# EAGLE board Rable (EAGLE 9.6.1), part 1 of 2
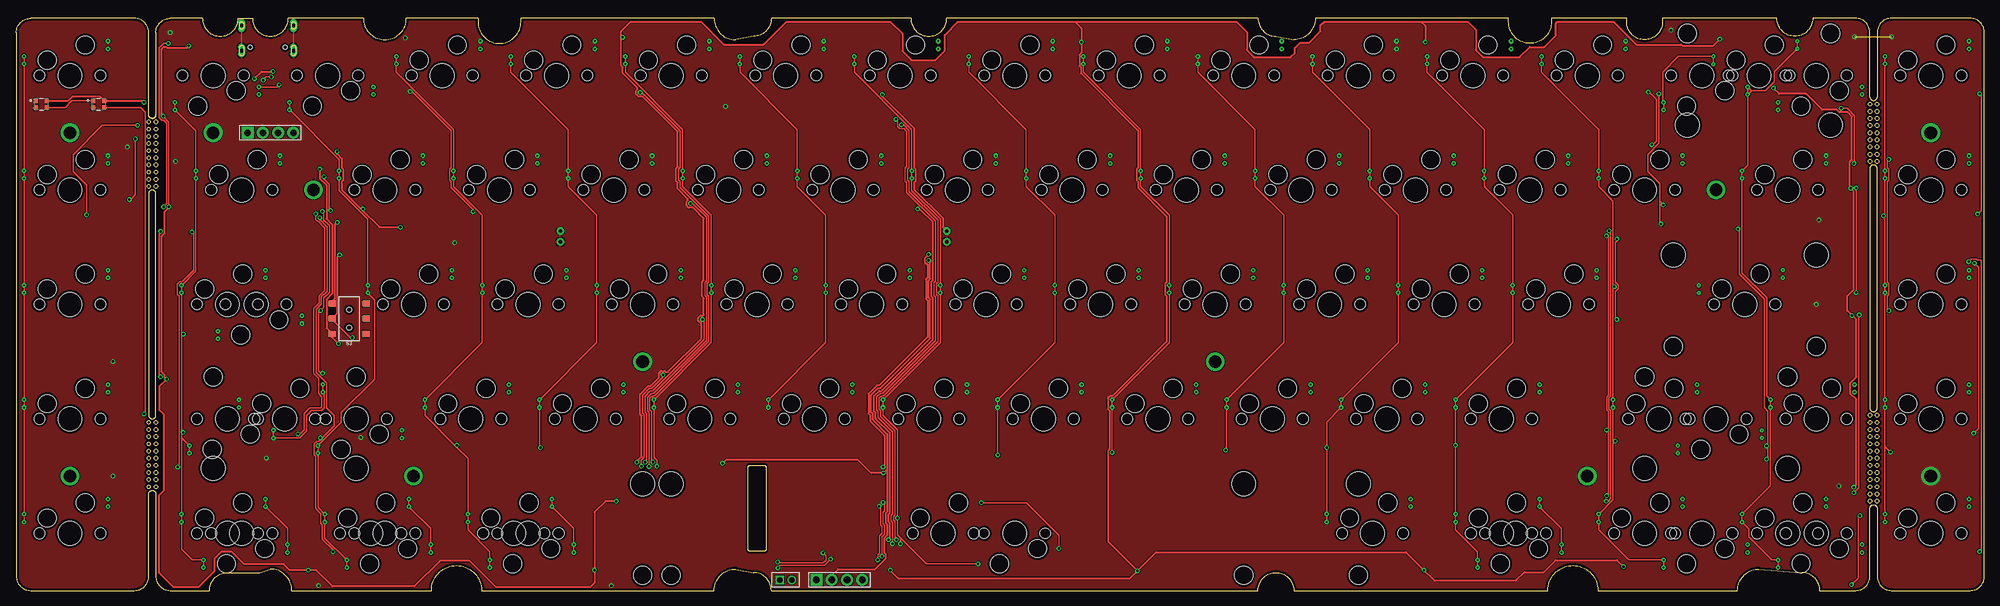
[diagram p2: board, top side]
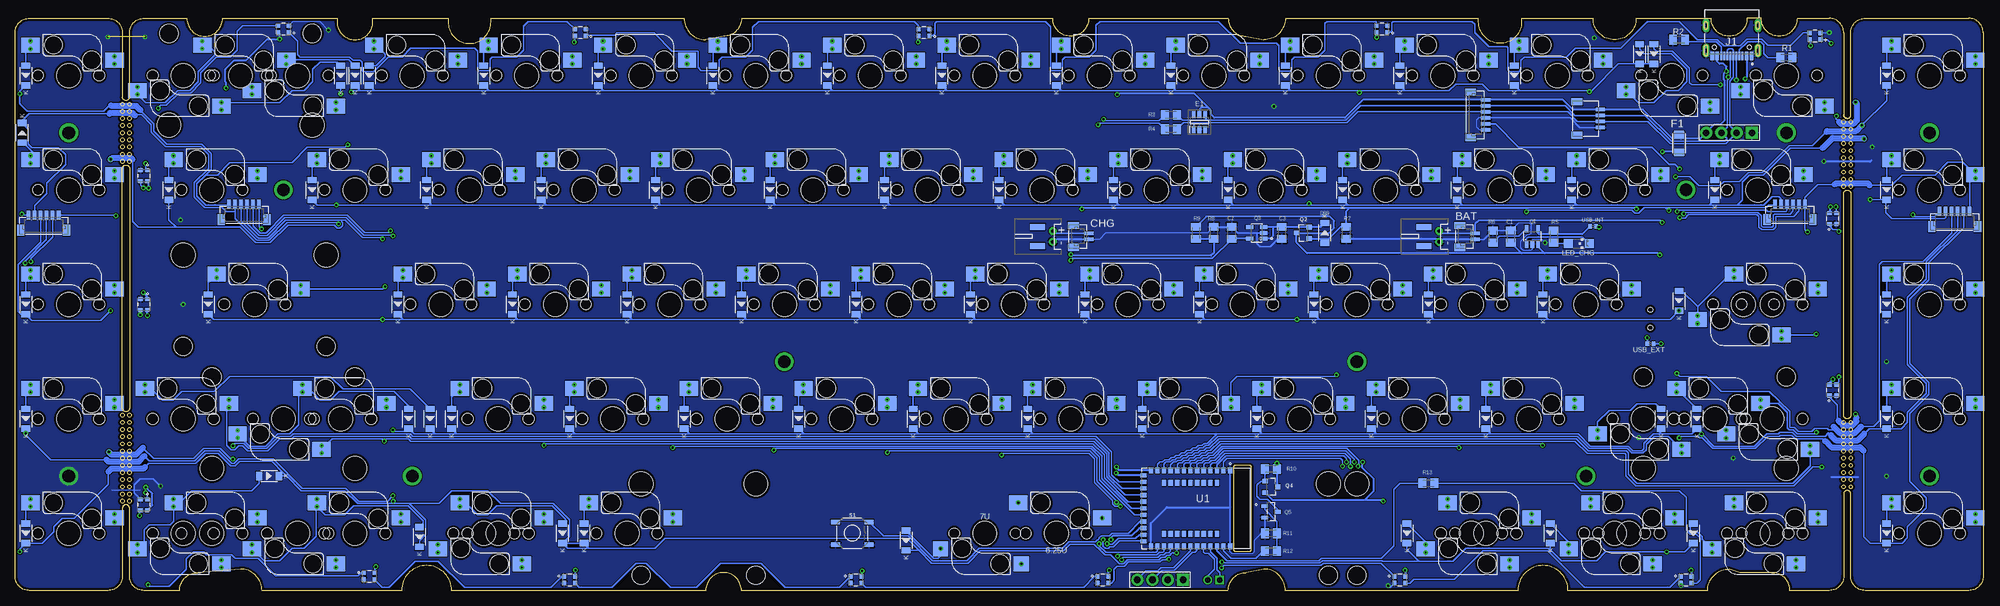
[diagram p3: board, bottom side, seen from below]

Size 327.42 x 95.25 mm. Coordinates in mm from the lower left corner, seen from the top.
Outline: 23.22,79.18 23.22,92.87 arc-90 25.6,95.25 30.96,95.25 arc90 33.93,92.27 arc90 36.91,95.25 39.29,95.25 arc90 42.27,92.27 arc90 45.24,95.25 57.75,95.25 arc90 61.32,91.68 arc90 64.89,95.25 76.8,95.25 76.8,94.65 arc90 80.37,91.08 arc90 83.94,94.65 83.94,95.25 116.09,95.25 arc90 119.66,91.68 122.63,92.27 arc90 125.61,95.25 148.83,95.25 arc90 151.81,92.27 arc90 154.78,95.25 206.57,95.25 arc90 209.55,92.27 212.53,91.68 arc90 216.1,95.25 248.25,95.25 248.25,94.65 arc90 251.82,91.08 arc90 255.39,94.65 255.39,95.25 267.89,95.25 267.89,94.65 arc90 270.87,91.68 arc90 273.84,94.65 273.84,95.25 292.89,95.25 arc90 295.87,92.27 arc90 298.85,95.25 305.99,95.25 arc-90 308.37,92.87 308.37,82.15 arc90 308.97,81.56 arc90 309.56,82.15 309.56,92.87 arc-90 311.94,95.25 325.04,95.25 arc-90 327.42,92.87 327.42,2.38 arc-90 325.04,0 311.94,0 arc-90 309.56,2.38 309.56,12.5 309.56,13.1 309.56,13.69 arc90 308.97,14.29 arc90 308.37,13.69 308.37,13.1 308.37,2.38 arc-90 305.99,0 300.04,0 arc90 297.06,2.98 289.92,3.57 arc90 286.35,0 263.13,0 arc90 258.96,4.17 arc90 254.79,0 212.53,0 arc90 209.55,2.98 arc90 206.57,0 125.61,0 arc90 122.63,2.98 119.66,3.57 arc90 116.09,0 77.39,0 arc90 73.22,4.17 arc90 69.06,0 45.84,0 arc90 42.27,3.57 40.48,2.98 35.12,2.98 arc90 32.15,0 25.6,0 arc-90 23.22,2.38 23.22,16.07 arc90 22.62,16.67 arc90 22.03,16.07 22.03,2.38 arc-90 19.65,0 2.38,0 arc-90 0,2.38 0,92.87 arc-90 2.38,95.25 19.65,95.25 arc-90 22.03,92.87 22.03,79.18 arc90 22.62,78.58
Outline: 22.62,78.58 arc90 23.22,79.18
Outline: 23.22,79.18 arc-90 22.62,78.58
Outline: 121.74,20.54 arc-90 122.04,20.84 124.42,20.84 arc-90 124.72,20.54 124.72,6.85 arc-90 124.42,6.55 122.04,6.55 arc-90 121.74,6.85 121.74,20.54
Outline: 22.03,29.17 arc90 22.62,28.58 arc90 23.22,29.17 23.22,66.08 arc90 22.62,66.67 arc90 22.03,66.08 22.03,29.17
Outline: 309.56,70.25 arc90 308.97,70.84 arc90 308.37,70.25 308.37,30.36 arc90 308.97,29.77 arc90 309.56,30.36 309.56,70.25
Outline: circle at 22.03,17.26 radius 0.3
Outline: circle at 22.03,18.45 radius 0.3
Outline: circle at 22.03,19.65 radius 0.3
Outline: circle at 22.03,20.84 radius 0.3
Outline: circle at 22.03,22.03 radius 0.3
Outline: circle at 22.03,23.22 radius 0.3
Outline: circle at 22.03,24.41 radius 0.3
Outline: circle at 22.03,25.6 radius 0.3
Outline: circle at 22.03,26.79 radius 0.3
Outline: circle at 22.03,27.98 radius 0.3
Outline: circle at 23.22,27.98 radius 0.3
Outline: circle at 23.22,26.79 radius 0.3
Outline: circle at 23.22,25.6 radius 0.3
Outline: circle at 23.22,24.41 radius 0.3
Outline: circle at 23.22,23.22 radius 0.3
Outline: circle at 23.22,22.03 radius 0.3
Outline: circle at 23.22,20.84 radius 0.3
Outline: circle at 23.22,19.65 radius 0.3
Outline: circle at 23.22,18.45 radius 0.3
Outline: circle at 23.22,17.26 radius 0.3
Copper layers (1*16): Top 0.035mm / dielectric 1.5mm / Bottom 0.035mm
Design rules "default *": minimum track width 6mil, minimum drill 0.35mm, track to track 6mil, track to pad 6mil, pad to pad 6mil, via to via 6mil, smd to smd 6mil, copper to edge 15mil, drill to drill 6mil, minimum pad ring 10mil, minimum via ring 8mil, stop-mask expansion 4mil, vias tented up to drill 14mil, thermal gap 10mil

## Footprints (pad centres in the part's own frame; a part is rotated, then mirrored left to right if it is on the bottom)
MXHSPCB-1U = smd 3.058 x 2.5: MX1 7.614,2.54; MX2 -6.344,5.08 | drill 0.25 pad 0.406: P$1 7.62,3.175; P$2 7.62,1.905; P$3 -6.35,5.715; P$4 -6.35,4.445 | hole 4: 0,0 | hole 1.802: 5.08,0; -5.08,0 | hole 3: 3.81,2.54; -2.54,5.08
MXHSPCB-6.25U-FLIPPED = smd 3.058 x 2.5: MX1 7.614,2.54; MX2 -6.344,5.08 | hole 4: 0,0; -50,8.24; 50,8.24 | hole 1.802: 5.08,0; -5.08,0 | hole 3: 3.81,2.54; -2.54,5.08 | hole 3.05: -50,-7; 50,-7
MXHSPCB-7U = smd 2.55 x 2.5: MX1 7.36,2.54; MX2 -6.09,5.08 | hole 4: 0,0; -57.15,-8.24; 57.15,-8.24 | hole 1.7: 5.08,0; -5.08,0 | hole 3: 3.81,2.54; -2.54,5.08 | hole 3.05: -57.15,7; 57.15,7
JST-PH-2-THM-RA = drill 0.55 pad 1.27: 1 0.9,0; 2 -0.9,0 | smd 1 x 2.5: P$1 -1.6,2.54; P$2 1.6,2.54
MXHSPCB-2U = smd 3.058 x 2.5: MX1 7.614,2.54; MX2 -6.344,5.08 | drill 0.2 pad 0.406: P$1 7.62,3.175; P$2 7.62,1.905; P$3 -6.35,5.715; P$4 -6.35,4.445 | hole 4: 0,0; -11.9,-8.24; 11.9,-8.24 | hole 1.802: 5.08,0; -5.08,0 | hole 3: 3.81,2.54; -2.54,5.08 | hole 3.05: -11.9,7; 11.9,7
C0805 = smd 1.3 x 1.6: 1 -1,0; 2 1,0
SOD-123 = smd 1.037 x 1.474: A -1.635,0; C 1.635,0
SOT95P280X145-6N = smd 1.15 x 0.6: 1 -1.25,0.95; 2 -1.25,0; 3 -1.25,-0.95; 4 1.25,-0.95; 5 1.25,0; 6 1.25,0.95
MXHSPCB-2U-FLIPPED = smd 3.058 x 2.5: MX1 7.614,2.54; MX2 -6.344,5.08 | drill 0.2 pad 0.406: P$1 7.62,3.175; P$2 7.62,1.905; P$3 -6.35,5.715; P$4 -6.35,4.445 | hole 4: 0,0; -11.9,8.24; 11.9,8.24 | hole 1.802: 5.08,0; -5.08,0 | hole 3: 3.81,2.54; -2.54,5.08 | hole 3.05: -11.9,-7; 11.9,-7
RESC3216X125N = smd 1.2 x 1.82: 1 -1.505,0; 2 1.505,0
HRO_TYPE-C-31-M-12 = smd 0.6 x 1.45: A1B12 -3.25,5.095; A4B9 -2.45,5.095; B1A12 3.25,5.095; B4A9 2.45,5.095 | smd 0.3 x 1.45: A5 -1.25,5.095; A6 -0.25,5.095; A7 0.25,5.095; A8 1.25,5.095; B5 1.75,5.095; B6 0.75,5.095; B7 -0.75,5.095; B8 -1.75,5.095 | drill 0.65 pad 1.05 long: S1 -4.32,4.18; S2 4.32,4.18; S3 -4.32,0; S4 4.32,0 | hole 0.7: -2.89,3.65; 2.89,3.65
HEADER-4X1-2.54 = drill 1.1 pad 2 square: 1 -3.81,0 | drill 1.1 pad 2: 2 -1.27,0; 3 1.27,0; 4 3.81,0
1X02M = drill 0.914 square: 1 -1,0 | drill 0.914: 2 1,0
CHIPLED_1206 = smd 1.5 x 1.5: A 0,-1.75; C 0,1.75
LTC4054 = smd 0.62 x 1.22: 1 -0.95,-1.3; 2 0,-1.3; 3 0.95,-1.3; 4 0.95,1.3; 5 -0.95,1.3
SOT23-3 = smd 0.8 x 0.9: 1 -0.95,-1; 2 0.95,-1; 3 0,1.1
SOT95P285X140-5N = smd 1.35 x 0.6: 1 -1.185,0.95; 2 -1.185,0; 3 -1.185,-0.95; 4 1.185,-0.95; 5 1.185,0.95
SOT95P240X111-3N = smd 1.23 x 0.6: 1 -1.06,0.95; 2 -1.06,-0.95; 3 1.06,0
R0805 = smd 1.3 x 1.6: 1 -1,0; 2 1,0
LED_WS2812-2020 = smd 0.7 x 0.7: 1 -0.915,0.55; 2 -0.915,-0.55; 3 0.915,-0.55; 4 0.915,0.55
TACTILE_SWITCH_SMD_5.2MM = smd 1.524 x 0.762: 1 -2.794,1.905; 2 2.794,1.905; 3 -2.794,-1.905; 4 2.794,-1.905
SWITCH_DPDT_SMD_AYZ0202 = smd 1 x 1.15: 1 -2.5,2.825; 2 0,2.825; 3 2.5,2.825; 4 -2.5,-2.825; 5 0,-2.825; 6 2.5,-2.825 | hole 0.85: 1.5,0; -1.5,0
XCVR_HOLYIOT-18010-NRF52840 = smd 1 x 0.7: 1 -6.35,5.7; 2 -6.35,4.6; 3 -6.35,3.5; 4 -6.35,2.4; 5 -6.35,1.3; 6 -6.35,0.2; 7 -6.35,-0.9; 8 -6.35,-2; 9 -6.35,-3.1; 10 -6.35,-4.2; 11 -6.35,-5.3; 12 -6.35,-6.4; 13 -6.35,-7.5; 25 6.35,-7.5; 26 6.35,-6.4; 27 6.35,-5.3; 28 6.35,-4.2; 29 6.35,-3.1; 30 6.35,-2; 31 6.35,-0.9; 32 6.35,0.2; 33 6.35,1.3; 34 6.35,2.4; 35 6.35,3.5; 36 6.35,4.6; 37 6.35,5.7; 38 -4.25,3.5; 39 -4.25,2.4; 40 -4.25,1.3; 41 -4.25,0.2; 42 -4.25,-0.9; 43 -4.25,-2; 44 -4.25,-3.1; 45 -4.25,-4.2; 46 -4.25,-5.3; 47 4.25,3.5; 48 4.25,2.4; 49 4.25,1.3; 50 4.25,0.2; 51 4.25,-0.9; 52 4.25,-2; 53 4.25,-3.1; 54 4.25,-4.2; 55 4.25,-5.3 | smd 0.7 x 1: 14 -5.5,-8.7; 15 -4.4,-8.7; 16 -3.3,-8.7; 17 -2.2,-8.7; 18 -1.1,-8.7; 19 0,-8.7; 20 1.1,-8.7; 21 2.2,-8.7; 22 3.3,-8.7; 23 4.4,-8.7; 24 5.5,-8.7
R0402 = smd 0.6 x 0.7: 1 -0.5,0; 2 0.5,0
SM04B-SRSS-TB = smd 0.6 x 1.55: 1 1.5,0; 2 0.5,0; 3 -0.5,0; 4 -1.5,0 | smd 1.2 x 1.8: M1 2.8,3.875; M2 -2.8,3.875
BM06B-SRSS-TB = smd 0.6 x 1.55: 1 2.5,0; 2 1.5,0; 3 0.5,0; 4 -0.5,0; 5 -1.5,0; 6 -2.5,0 | smd 1.2 x 1.8: M1 3.8,-2.525; M2 -3.8,-2.525
BM02B-SRSS-TB = smd 0.6 x 1.55: 1 0.5,0; 2 -0.5,0 | smd 1.2 x 1.8: M1 1.8,-2.525; M2 -1.8,-2.525

## Placement (x,y rotation side)
0  KEYSWITCH-PLAIN-MXHSPCB-1U  [MXHSPCB-1U]  223.24,85.73 0 bottom
1  KEYSWITCH-PLAIN-MXHSPCB-1U  [MXHSPCB-1U]  51.79,85.73 180 bottom
2  KEYSWITCH-PLAIN-MXHSPCB-1U  [MXHSPCB-1U]  70.84,85.73 0 bottom
3  KEYSWITCH-PLAIN-MXHSPCB-1U  [MXHSPCB-1U]  89.89,85.73 0 bottom
4  KEYSWITCH-PLAIN-MXHSPCB-1U  [MXHSPCB-1U]  108.94,85.73 0 bottom
5  KEYSWITCH-PLAIN-MXHSPCB-1U  [MXHSPCB-1U]  127.99,85.73 0 bottom
6  KEYSWITCH-PLAIN-MXHSPCB-1U  [MXHSPCB-1U]  147.04,85.73 0 bottom
6.25U  KEYSWITCH-PLAIN-MXHSPCB-6.25U-FLIPPED  [MXHSPCB-6.25U-FLIPPED]  154.19,9.52 0 bottom
7  KEYSWITCH-PLAIN-MXHSPCB-1U  [MXHSPCB-1U]  166.09,85.73 0 bottom
7U  KEYSWITCH-PLAIN-MXHSPCB-7U  [MXHSPCB-7U]  166.09,9.52 180 bottom
8  KEYSWITCH-PLAIN-MXHSPCB-1U  [MXHSPCB-1U]  185.14,85.73 0 bottom
9  KEYSWITCH-PLAIN-MXHSPCB-1U  [MXHSPCB-1U]  204.19,85.73 0 bottom
'  KEYSWITCH-PLAIN-MXHSPCB-1U  [MXHSPCB-1U]  256.58,47.62 0 bottom
,  KEYSWITCH-PLAIN-MXHSPCB-1U  [MXHSPCB-1U]  208.95,28.58 0 bottom
-  KEYSWITCH-PLAIN-MXHSPCB-1U  [MXHSPCB-1U]  242.29,85.73 0 bottom
.  KEYSWITCH-PLAIN-MXHSPCB-1U  [MXHSPCB-1U]  228,28.58 0 bottom
..  KEYSWITCH-PLAIN-MXHSPCB-1U  [MXHSPCB-1U]  237.53,47.62 0 bottom
/  KEYSWITCH-PLAIN-MXHSPCB-1U  [MXHSPCB-1U]  247.05,28.58 0 bottom
=  KEYSWITCH-PLAIN-MXHSPCB-1U  [MXHSPCB-1U]  261.34,85.73 0 bottom
=1  KEYSWITCH-PLAIN-MXHSPCB-1U  [MXHSPCB-1U]  318.49,85.73 0 bottom
=2  KEYSWITCH-PLAIN-MXHSPCB-1U  [MXHSPCB-1U]  318.49,66.67 0 bottom
=3  KEYSWITCH-PLAIN-MXHSPCB-1U  [MXHSPCB-1U]  318.49,47.62 0 bottom
=4  KEYSWITCH-PLAIN-MXHSPCB-1U  [MXHSPCB-1U]  318.49,28.58 0 bottom
=5  KEYSWITCH-PLAIN-MXHSPCB-1U  [MXHSPCB-1U]  318.49,9.52 0 bottom
[  KEYSWITCH-PLAIN-MXHSPCB-1U  [MXHSPCB-1U]  251.82,66.67 0 bottom
\/  KEYSWITCH-PLAIN-MXHSPCB-1U  [MXHSPCB-1U]  56.55,28.58 180 bottom
\\  KEYSWITCH-PLAIN-MXHSPCB-1U  [MXHSPCB-1U]  280.39,85.73 180 bottom
]  KEYSWITCH-PLAIN-MXHSPCB-1U  [MXHSPCB-1U]  270.87,66.67 0 bottom
A  KEYSWITCH-PLAIN-MXHSPCB-1U  [MXHSPCB-1U]  66.08,47.62 0 bottom
B  KEYSWITCH-PLAIN-MXHSPCB-1U  [MXHSPCB-1U]  151.8,28.58 0 bottom
BAT  [JST-PH-2-THM-RA]  90.49,58.94 90 bottom
BCKSPC  KEYSWITCH-PLAIN-MXHSPCB-2U  [MXHSPCB-2U]  289.92,85.73 0 bottom
C  KEYSWITCH-PLAIN-MXHSPCB-1U  [MXHSPCB-1U]  113.7,28.58 0 bottom
C1  4.7uf  [C0805]  78.58,58.94 270 bottom
C2  1uf  [C0805]  125.02,59.53 270 bottom
C3  1uf  [C0805]  116.68,59.53 90 bottom
CAPS  KEYSWITCH-PLAIN-MXHSPCB-1U  [MXHSPCB-1U]  35.12,47.62 0 bottom
CHG  [JST-PH-2-THM-RA]  154.78,58.94 90 bottom
D  KEYSWITCH-PLAIN-MXHSPCB-1U  [MXHSPCB-1U]  104.18,47.62 0 bottom
D1  [SOD-123]  54.77,89.3 270 bottom
D2  [SOD-123]  44.65,66.67 270 bottom
D3  [SOD-123]  50.6,48.22 270 bottom
D4  [SOD-123]  47.62,28.58 270 bottom
D5  [SOD-123]  48.22,9.52 270 bottom
D6  [SOD-123]  232.77,9.52 270 bottom
D7  [SOD-123]  236.34,9.52 270 bottom
D8  [SOD-123]  179.19,8.33 270 bottom
D9  [SOD-123]  285.15,19.05 0 bottom
D10  [SOD-123]  95.85,9.52 270 bottom
D11  [SOD-123]  72.03,9.52 270 bottom
D12  [SOD-123]  216.1,28.58 270 bottom
D13  [SOD-123]  258.37,28.58 270 bottom
D14  [SOD-123]  261.94,28.58 270 bottom
D15  [SOD-123]  254.79,28.58 270 bottom
D16  [SOD-123]  235.15,28.58 270 bottom
D17  [SOD-123]  197.05,28.58 270 bottom
D18  [SOD-123]  178,28.58 270 bottom
D19  [SOD-123]  158.95,28.58 270 bottom
D20  [SOD-123]  139.9,28.58 270 bottom
D21  [SOD-123]  120.85,28.58 270 bottom
D22  [SOD-123]  57.15,89.3 270 bottom
D23  [SOD-123]  77.99,85.73 270 bottom
D24  [SOD-123]  97.04,85.73 270 bottom
D25  [SOD-123]  116.09,85.73 270 bottom
D26  [SOD-123]  135.14,85.73 270 bottom
D27  [SOD-123]  154.19,85.73 270 bottom
D28  [SOD-123]  173.24,85.73 270 bottom
D29  [SOD-123]  192.29,85.73 270 bottom
D30  [SOD-123]  230.39,85.73 270 bottom
D31  [SOD-123]  249.44,85.73 270 bottom
D32  [SOD-123]  268.49,85.73 270 bottom
D33  [SOD-123]  270.87,85.73 270 bottom
D34  [SOD-123]  273.25,85.73 270 bottom
D35  [SOD-123]  101.8,28.58 270 bottom
D36  [SOD-123]  211.34,85.73 270 bottom
D37  [SOD-123]  68.46,66.67 270 bottom
D38  [SOD-123]  87.51,66.67 270 bottom
D39  [SOD-123]  106.56,66.67 270 bottom
D40  [SOD-123]  125.61,66.67 270 bottom
D41  [SOD-123]  144.66,66.67 270 bottom
D42  [SOD-123]  163.71,66.67 270 bottom
D43  [SOD-123]  182.76,66.67 270 bottom
D44  [SOD-123]  201.81,66.67 270 bottom
D45  [SOD-123]  239.91,66.67 270 bottom
D46  [SOD-123]  258.96,66.67 270 bottom
D47  [SOD-123]  278.01,66.67 270 bottom
D48  [SOD-123]  301.82,66.67 270 bottom
D49  [SOD-123]  73.22,47.62 270 bottom
D50  [SOD-123]  225.62,47.62 270 bottom
D51  [SOD-123]  220.86,66.67 270 bottom
D52  [SOD-123]  92.27,47.62 270 bottom
D53  [SOD-123]  111.32,47.62 270 bottom
D54  [SOD-123]  130.37,47.62 270 bottom
D55  [SOD-123]  149.42,47.62 270 bottom
D56  [SOD-123]  168.47,47.62 270 bottom
D57  [SOD-123]  187.52,47.62 270 bottom
D58  [SOD-123]  206.57,47.62 270 bottom
D59  [SOD-123]  244.67,47.62 270 bottom
D60  [SOD-123]  263.72,47.62 270 bottom
D61  [SOD-123]  295.27,47.62 270 bottom
D62  [SOD-123]  53.58,28.58 270 bottom
D63  [SOD-123]  82.75,28.58 270 bottom
D64  [SOD-123]  260.15,8.93 270 bottom
D65  [SOD-123]  16.07,85.73 270 bottom
D66  [SOD-123]  16.07,66.67 270 bottom
D67  [SOD-123]  16.07,47.62 270 bottom
D68  [SOD-123]  16.07,28.58 270 bottom
D69  [SOD-123]  16.07,9.52 270 bottom
D70  [SOD-123]  325.64,85.73 270 bottom
D71  [SOD-123]  326.23,76.2 90 bottom
D72  [SOD-123]  325.64,47.62 270 bottom
D73  [SOD-123]  325.64,28.58 270 bottom
D74  [SOD-123]  325.64,9.52 270 bottom
D99  1N5819  [SOD-123]  109.54,59.53 90 bottom
DEL  KEYSWITCH-PLAIN-MXHSPCB-1U  [MXHSPCB-1U]  299.44,85.73 180 bottom
E  KEYSWITCH-PLAIN-MXHSPCB-1U  [MXHSPCB-1U]  99.42,66.67 0 bottom
E1  SRV05-4.TCT  [SOT95P280X145-6N]  130.37,77.99 90 bottom
ENTER  KEYSWITCH-PLAIN-MXHSPCB-2U-FLIPPED  [MXHSPCB-2U-FLIPPED]  287.54,47.62 0 bottom
F  KEYSWITCH-PLAIN-MXHSPCB-1U  [MXHSPCB-1U]  123.23,47.62 0 bottom
F1  500mA  [RESC3216X125N]  50.6,74.41 270 bottom
FN  KEYSWITCH-PLAIN-MXHSPCB-1U  [MXHSPCB-1U]  299.44,28.58 0 bottom
G  KEYSWITCH-PLAIN-MXHSPCB-1U  [MXHSPCB-1U]  142.28,47.62 0 bottom
H  KEYSWITCH-PLAIN-MXHSPCB-1U  [MXHSPCB-1U]  161.33,47.62 0 bottom
I  KEYSWITCH-PLAIN-MXHSPCB-1U  [MXHSPCB-1U]  194.67,66.67 0 bottom
J  KEYSWITCH-PLAIN-MXHSPCB-1U  [MXHSPCB-1U]  180.38,47.62 0 bottom
J1  TYPE-C-31-M-12  [HRO_TYPE-C-31-M-12]  41.81,94.06 180 bottom
J3  I2C-HEADER  [HEADER-4X1-2.54]  136.92,1.79 0 top
J4  I2C-HEADER  [HEADER-4X1-2.54]  42.27,76.2 0 top
JP1  [1X02M]  127.99,1.79 0 top
K  KEYSWITCH-PLAIN-MXHSPCB-1U  [MXHSPCB-1U]  199.43,47.62 0 bottom
L  KEYSWITCH-PLAIN-MXHSPCB-1U  [MXHSPCB-1U]  218.48,47.62 0 bottom
LALT  KEYSWITCH-PLAIN-MXHSPCB-1U  [MXHSPCB-1U]  85.13,9.52 180 bottom
LALT1  KEYSWITCH-PLAIN-MXHSPCB-1U  [MXHSPCB-1U]  82.75,9.52 0 bottom
LCTRL  KEYSWITCH-PLAIN-MXHSPCB-1U  [MXHSPCB-1U]  37.5,9.52 180 bottom
LCTRL1  KEYSWITCH-PLAIN-MXHSPCB-1U  [MXHSPCB-1U]  35.12,9.52 0 bottom
LED_CHG  [CHIPLED_1206]  67.27,57.75 270 bottom
LSHIFT  KEYSWITCH-PLAIN-MXHSPCB-1U  [MXHSPCB-1U]  35.12,28.58 180 bottom
LSHIFT1  KEYSWITCH-PLAIN-MXHSPCB-2U  [MXHSPCB-2U]  44.65,28.58 0 bottom
LWIN  KEYSWITCH-PLAIN-MXHSPCB-1U  [MXHSPCB-1U]  61.32,9.52 180 bottom
LWIN1  KEYSWITCH-PLAIN-MXHSPCB-1U  [MXHSPCB-1U]  58.94,9.52 0 bottom
M  KEYSWITCH-PLAIN-MXHSPCB-1U  [MXHSPCB-1U]  189.9,28.58 0 bottom
N  KEYSWITCH-PLAIN-MXHSPCB-1U  [MXHSPCB-1U]  170.85,28.58 0 bottom
O  KEYSWITCH-PLAIN-MXHSPCB-1U  [MXHSPCB-1U]  213.72,66.67 0 bottom
P  KEYSWITCH-PLAIN-MXHSPCB-1U  [MXHSPCB-1U]  232.77,66.67 0 bottom
Q  KEYSWITCH-PLAIN-MXHSPCB-1U  [MXHSPCB-1U]  61.32,66.67 0 bottom
Q1  LTC4054  [LTC4054]  75.01,58.94 0 bottom
Q2  AO3401  [SOT23-3]  113.11,59.53 90 bottom
Q3  AP2112K-3.3TRG1  [SOT95P285X140-5N]  120.85,59.53 180 bottom
Q4  AO3401  [SOT23-3]  118.47,17.26 270 bottom
Q5  2N7002  [SOT95P240X111-3N]  118.47,13.1 0 bottom
R  KEYSWITCH-PLAIN-MXHSPCB-1U  [MXHSPCB-1U]  118.47,66.67 0 bottom
R1  5.1k  [R0805]  32.74,88.7 180 bottom
R2  5.1k  [R0805]  50.6,91.68 0 bottom
R3  22R  [R0805]  135.14,79.18 180 bottom
R4  22R  [R0805]  135.14,76.8 180 bottom
R5  1k  [R0805]  71.44,58.94 90 bottom
R6  10k/2k  [R0805]  81.56,58.94 270 bottom
R7  10k  [R0805]  105.97,59.53 90 bottom
R8  2M  [R0805]  127.99,59.53 90 bottom
R9  806k  [R0805]  130.97,59.53 270 bottom
R10  10k  [R0805]  118.47,20.24 0 bottom
R11  10k  [R0805]  118.47,9.52 0 bottom
R12  100  [R0805]  118.47,6.55 180 bottom
R13  330  [R0805]  92.27,17.86 0 bottom
RALT1  KEYSWITCH-PLAIN-MXHSPCB-1U  [MXHSPCB-1U]  225.62,9.52 0 bottom
RCTRL  KEYSWITCH-PLAIN-MXHSPCB-1U  [MXHSPCB-1U]  294.68,9.52 0 bottom
RCTRL1  KEYSWITCH-PLAIN-MXHSPCB-1U  [MXHSPCB-1U]  299.44,9.52 180 bottom
RGB1  WS2812-2020  [LED_WS2812-2020]  49.41,1.79 0 bottom
RGB2  WS2812-2020  [LED_WS2812-2020]  97.04,1.79 0 bottom
RGB3  WS2812-2020  [LED_WS2812-2020]  146.45,1.79 0 bottom
RGB4  WS2812-2020  [LED_WS2812-2020]  187.52,1.79 0 bottom
RGB5  WS2812-2020  [LED_WS2812-2020]  235.15,1.79 0 bottom
RGB6  WS2812-2020  [LED_WS2812-2020]  268.49,2.38 0 bottom
RGB7  WS2812-2020  [LED_WS2812-2020]  305.99,14.29 270 bottom
RGB8  WS2812-2020  [LED_WS2812-2020]  305.99,47.62 270 bottom
RGB9  WS2812-2020  [LED_WS2812-2020]  305.99,69.06 270 bottom
RGB10  WS2812-2020  [LED_WS2812-2020]  282.77,93.46 180 bottom
RGB11  WS2812-2020  [LED_WS2812-2020]  233.36,92.87 180 bottom
RGB12  WS2812-2020  [LED_WS2812-2020]  176.21,92.87 180 bottom
RGB13  WS2812-2020  [LED_WS2812-2020]  100.01,93.46 180 bottom
RGB14  WS2812-2020  [LED_WS2812-2020]  27.98,92.27 180 bottom
RGB15  WS2812-2020  [LED_WS2812-2020]  25,61.91 90 bottom
RGB16  WS2812-2020  [LED_WS2812-2020]  25,33.34 90 bottom
RGB17  WS2812-2020  [LED_WS2812-2020]  13.69,80.96 0 top
RGB18  WS2812-2020  [LED_WS2812-2020]  4.17,80.96 0 top
RSHIFT1  KEYSWITCH-PLAIN-MXHSPCB-2U-FLIPPED  [MXHSPCB-2U-FLIPPED]  282.77,28.58 180 bottom
RSHIFT2  KEYSWITCH-PLAIN-MXHSPCB-1U  [MXHSPCB-1U]  273.25,28.58 0 bottom
RWIN  KEYSWITCH-PLAIN-MXHSPCB-1U  [MXHSPCB-1U]  247.05,9.52 0 bottom
RWIN1  KEYSWITCH-PLAIN-MXHSPCB-1U  [MXHSPCB-1U]  249.44,9.52 180 bottom
RWIN2  KEYSWITCH-PLAIN-MXHSPCB-1U  [MXHSPCB-1U]  270.87,9.52 0 bottom
RWIN3  KEYSWITCH-PLAIN-MXHSPCB-1U  [MXHSPCB-1U]  280.39,9.52 180 bottom
S  KEYSWITCH-PLAIN-MXHSPCB-1U  [MXHSPCB-1U]  85.13,47.62 0 bottom
S1  MOMENTARY-SWITCH-SPST-SMD-5.2-TALL-REDUNDANT  [TACTILE_SWITCH_SMD_5.2MM]  188.12,9.52 0 bottom
S3  [SWITCH_DPDT_SMD_AYZ0202]  55.36,45.24 90 top
STEPED  KEYSWITCH-PLAIN-MXHSPCB-1U  [MXHSPCB-1U]  39.89,47.62 180 bottom
T  KEYSWITCH-PLAIN-MXHSPCB-1U  [MXHSPCB-1U]  137.52,66.67 0 bottom
TAB  KEYSWITCH-PLAIN-MXHSPCB-1U  [MXHSPCB-1U]  37.5,66.67 0 bottom
TAB1  KEYSWITCH-PLAIN-MXHSPCB-1U  [MXHSPCB-1U]  8.93,66.67 0 bottom
TAB2  KEYSWITCH-PLAIN-MXHSPCB-1U  [MXHSPCB-1U]  8.93,47.62 0 bottom
TAB3  KEYSWITCH-PLAIN-MXHSPCB-1U  [MXHSPCB-1U]  8.93,28.58 0 bottom
TAB4  KEYSWITCH-PLAIN-MXHSPCB-1U  [MXHSPCB-1U]  8.93,9.52 0 bottom
U  KEYSWITCH-PLAIN-MXHSPCB-1U  [MXHSPCB-1U]  175.62,66.67 0 bottom
U1  HOLYIOT-18010-NRF52840  [XCVR_HOLYIOT-18010-NRF52840]  130.97,13.69 270 bottom
USB_EXT  [R0402]  55.36,41.08 180 bottom
USB_INT  [R0402]  64.87,60.64 0 bottom
V  KEYSWITCH-PLAIN-MXHSPCB-1U  [MXHSPCB-1U]  132.75,28.58 0 bottom
W  KEYSWITCH-PLAIN-MXHSPCB-1U  [MXHSPCB-1U]  80.37,66.67 0 bottom
X  KEYSWITCH-PLAIN-MXHSPCB-1U  [MXHSPCB-1U]  94.65,28.58 0 bottom
X1  SM04B-SRSS-TB  [SM04B-SRSS-TB]  63.7,78.58 90 bottom
X2  BM06B-SRSS-TB  [BM06B-SRSS-TB]  32.15,64.29 0 bottom
X3  BM06B-SRSS-TB  [BM06B-SRSS-TB]  289.32,64.29 0 bottom
X4  BM06B-SRSS-TB  [BM06B-SRSS-TB]  82.75,79.18 270 bottom
X5  BM02B-SRSS-TB  [BM02B-SRSS-TB]  148.83,58.94 270 bottom
X6  BM02B-SRSS-TB  [BM02B-SRSS-TB]  84.53,58.94 270 bottom
X7  BM06B-SRSS-TB  [BM06B-SRSS-TB]  4.76,63.1 0 bottom
X8  BM06B-SRSS-TB  [BM06B-SRSS-TB]  322.66,62.51 0 bottom
Y  KEYSWITCH-PLAIN-MXHSPCB-1U  [MXHSPCB-1U]  156.57,66.67 0 bottom
Z  KEYSWITCH-PLAIN-MXHSPCB-1U  [MXHSPCB-1U]  75.6,28.58 0 bottom
|  KEYSWITCH-PLAIN-MXHSPCB-1U  [MXHSPCB-1U]  294.68,66.67 0 bottom
~  KEYSWITCH-PLAIN-MXHSPCB-1U  [MXHSPCB-1U]  32.74,85.73 180 bottom
~1  KEYSWITCH-PLAIN-MXHSPCB-1U  [MXHSPCB-1U]  8.93,85.73 0 bottom